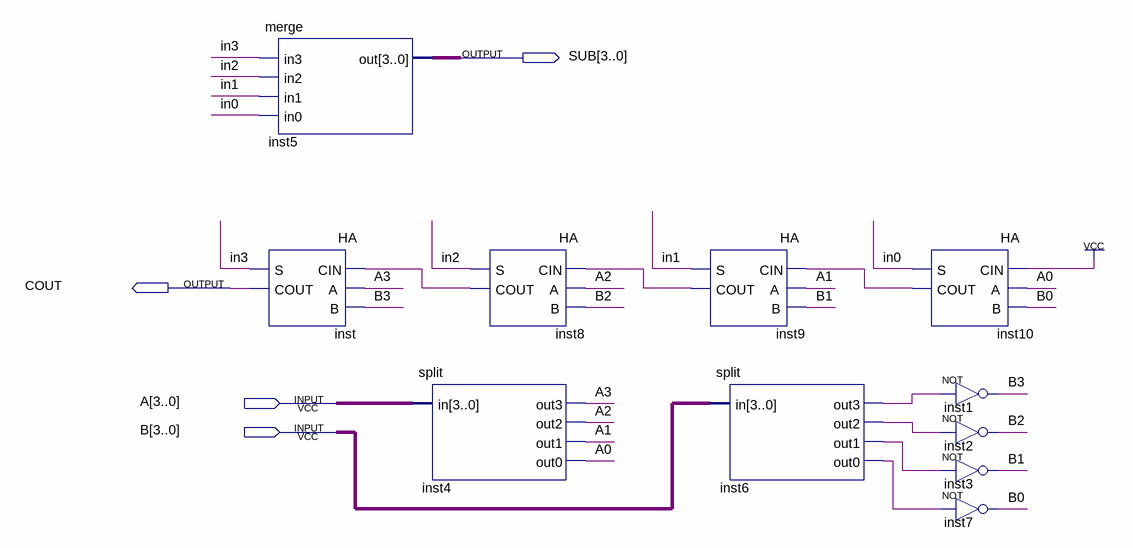
[diagram p0: schematic sheet]
// Quartus schematic SUB.bdf as structural Verilog: 11 symbols, 4 pins
module SUB (
  input  [3:0] A,
  input  [3:0] B,
  output [3:0] SUB,
  output COUT
);

  wire in0, in1, in2, in3, inst6_out0, inst6_out1, inst6_out2, inst6_out3, inst8_cout, inst9_cout,
       inst10_cout;

  merge inst5 (.in3(in3), .in2(in2), .in1(in1), .in0(in0), .out(SUB));
  HA inst (.CIN(inst8_cout), .A(A[3]), .B(B[3]), .S(in3), .COUT(COUT));
  split inst4 (.in(A), .out3(A[3]), .out2(A[2]), .out1(A[1]), .out0(A[0]));
  HA inst8 (.CIN(inst9_cout), .A(A[2]), .B(B[2]), .S(in2), .COUT(inst8_cout));
  HA inst9 (.CIN(inst10_cout), .A(A[1]), .B(B[1]), .S(in1), .COUT(inst9_cout));
  split inst6 (.in(B), .out3(inst6_out3), .out2(inst6_out2), .out1(inst6_out1), .out0(inst6_out0));
  HA inst10 (.CIN(1'b1), .A(A[0]), .B(B[0]), .S(in0), .COUT(inst10_cout));
  not inst1 (B[3], inst6_out3);
  not inst2 (B[2], inst6_out2);
  not inst3 (B[1], inst6_out1);
  not inst7 (B[0], inst6_out0);
endmodule
